# Altium schematic sheet tabdil motor.SchDoc
size A
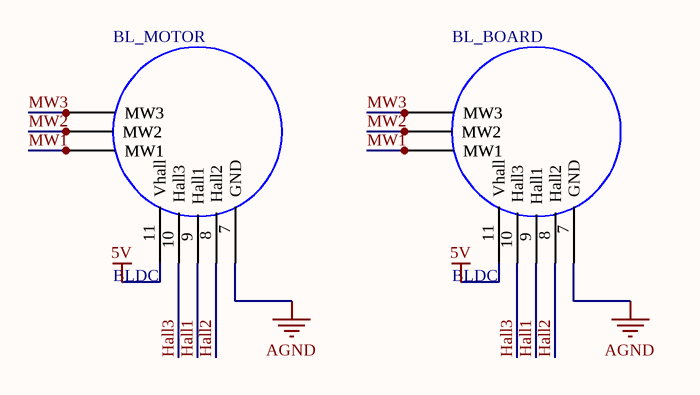
[diagram p0: tabdil motor.SchDoc]

## Parts
BL_BOARD  BLDC  [FLT11]
BL_MOTOR  BLDC  [FLT11]

## Nets
5V: BL_BOARD.11(Vhall) BL_MOTOR.11(Vhall)
AGND: BL_BOARD.7(GND) BL_MOTOR.7(GND)
Hall1: BL_BOARD.9(Hall1) BL_MOTOR.9(Hall1)
Hall2: BL_BOARD.8(Hall2) BL_MOTOR.8(Hall2)
Hall3: BL_BOARD.10(Hall3) BL_MOTOR.10(Hall3)
MW1: BL_BOARD.1(MW1) BL_BOARD.2(MW1) BL_MOTOR.1(MW1) BL_MOTOR.2(MW1)
MW2: BL_BOARD.3(MW2) BL_BOARD.4(MW2) BL_MOTOR.3(MW2) BL_MOTOR.4(MW2)
MW3: BL_BOARD.5(MW3) BL_BOARD.6(MW3) BL_MOTOR.5(MW3) BL_MOTOR.6(MW3)